# EAGLE schematic PLCPart (EAGLE 9.6.2)
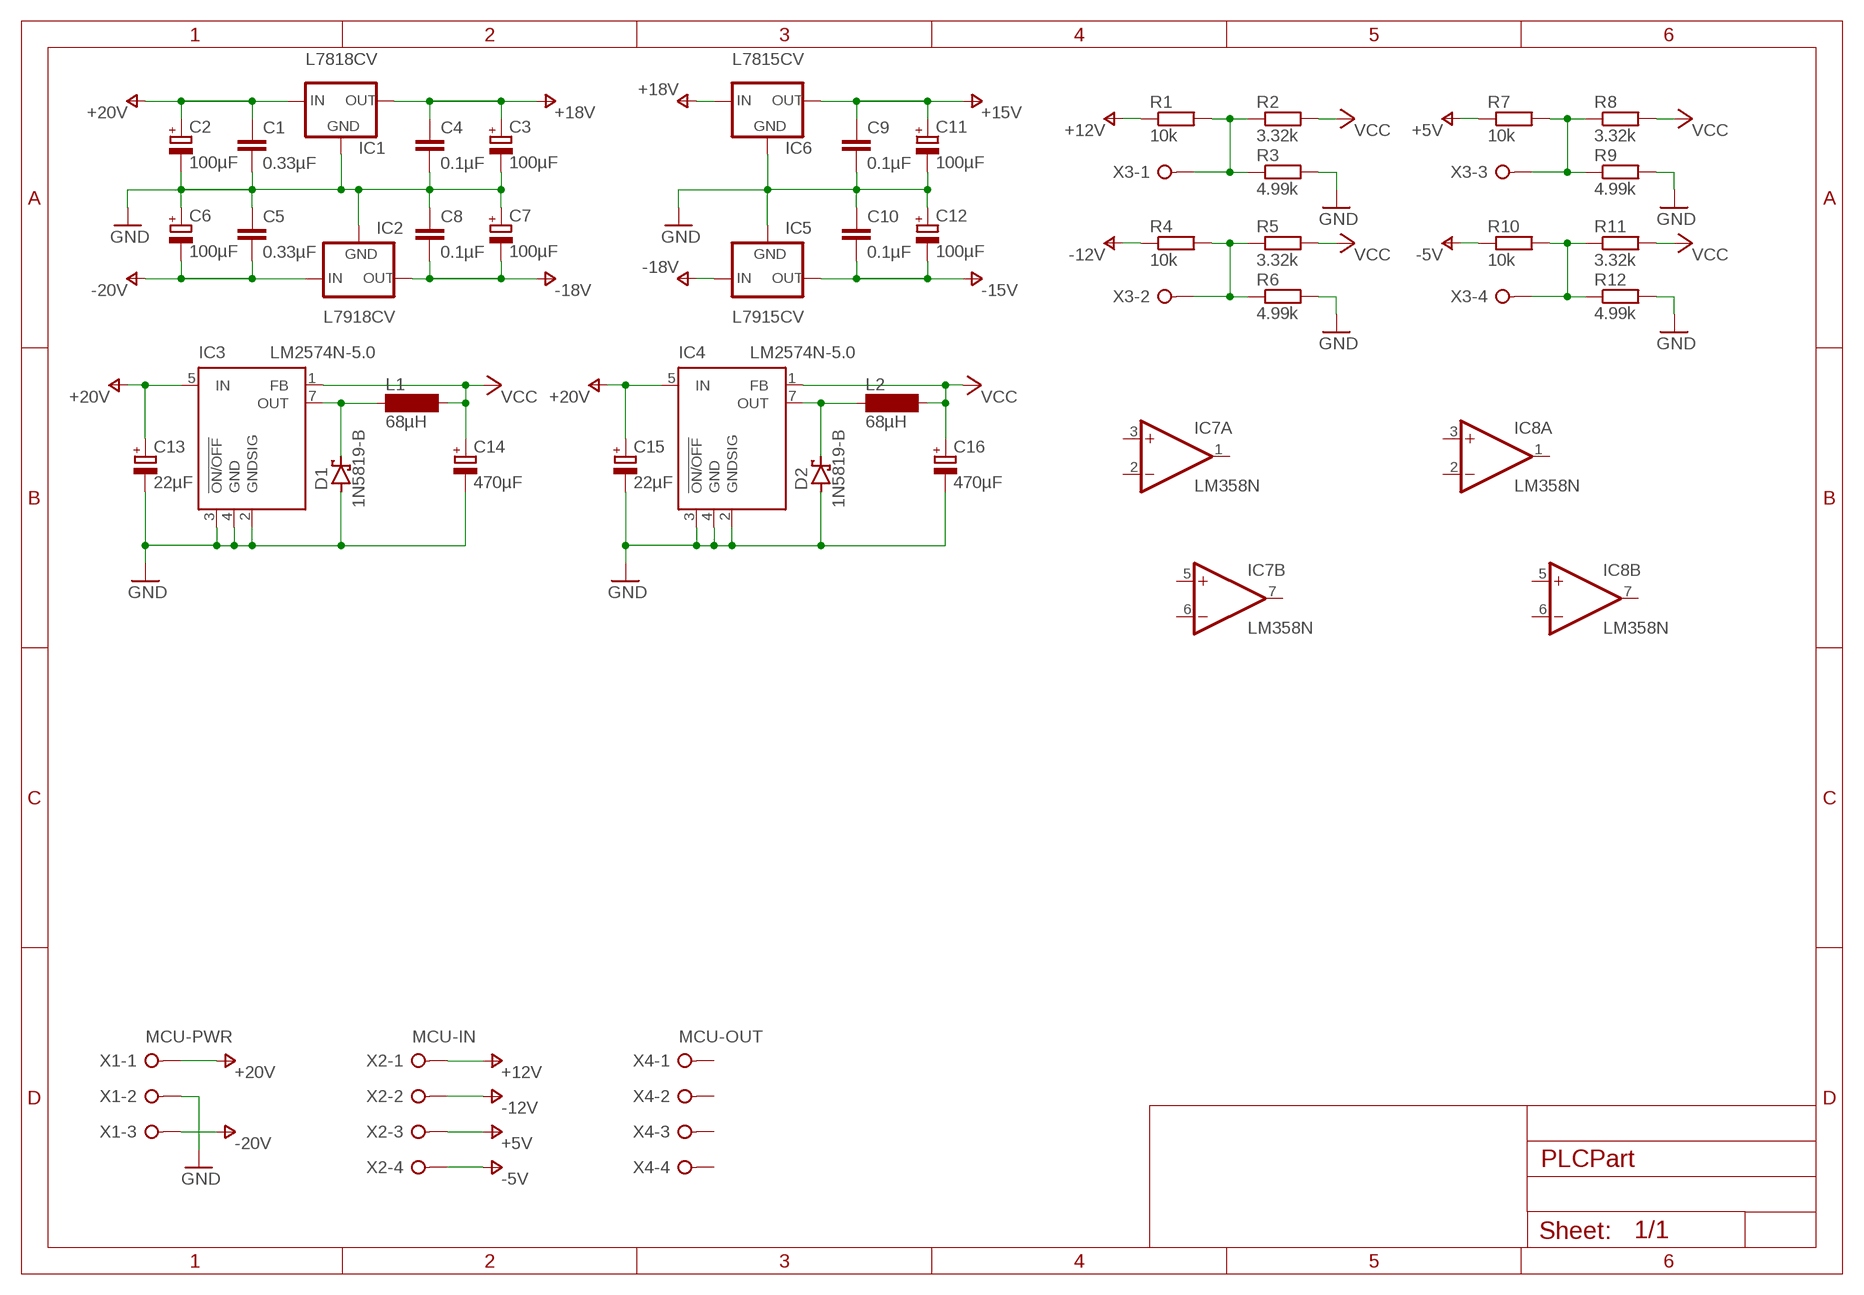
[diagram p0: schematic, sheet 1]

## Parts
C1  0.33µF  C-EU050-024X044  [C050-024X044]
C2  100µF  CPOL-EUE2.5-6  [E2,5-6]
C3  100µF  CPOL-EUE2.5-6  [E2,5-6]
C4  0.1µF  C-EU050-024X044  [C050-024X044]
C5  0.33µF  C-EU050-024X044  [C050-024X044]
C6  100µF  CPOL-EUE2.5-6  [E2,5-6]
C7  100µF  CPOL-EUE2.5-6  [E2,5-6]
C8  0.1µF  C-EU050-024X044  [C050-024X044]
C9  0.1µF  C-EU050-024X044  [C050-024X044]
C10  0.1µF  C-EU050-024X044  [C050-024X044]
C11  100µF  CPOL-EUE2.5-6  [E2,5-6]
C12  100µF  CPOL-EUE2.5-6  [E2,5-6]
C13  22µF  CPOL-EUE2-5  [E2-5]
C14  470µF  CPOL-EUE2-5  [E2-5]
C15  22µF  CPOL-EUE2-5  [E2-5]
C16  470µF  CPOL-EUE2-5  [E2-5]
D1  1N5819-B  [DO41-7.6]
D2  1N5819-B  [DO41-7.6]
IC1  L7818CV  78XXS  [78XXS]
IC2  L7918CV  79XXS  [79XXS]
IC3  LM2574N-5.0  [DIL08]
IC4  LM2574N-5.0  [DIL08]
IC5  L7915CV  79XXS  [79XXS]
IC6  L7815CV  78XXS  [78XXS]
IC7  LM358N  [DIL08]
IC8  LM358N  [DIL08]
L1  68µH  SD12K100  [SD12K100]
L2  68µH  SD12K100  [SD12K100]
R1  10k  R-EU_0207/10  [0207/10]
R2  3.32k  R-EU_0207/10  [0207/10]
R3  4.99k  R-EU_0207/10  [0207/10]
R4  10k  R-EU_0207/10  [0207/10]
R5  3.32k  R-EU_0207/10  [0207/10]
R6  4.99k  R-EU_0207/10  [0207/10]
R7  10k  R-EU_0207/10  [0207/10]
R8  3.32k  R-EU_0207/10  [0207/10]
R9  4.99k  R-EU_0207/10  [0207/10]
R10  10k  R-EU_0207/10  [0207/10]
R11  3.32k  R-EU_0207/10  [0207/10]
R12  4.99k  R-EU_0207/10  [0207/10]
X1  MCU-PWR  W237-03P  [W237-133]
X2  MCU-IN  W237-04P  [W237-4P]
X3  W237-04P  [W237-4P]
X4  MCU-OUT  W237-04P  [W237-4P]

## Nets
+5V: R7.1 X2.3
+12V: R1.1 X2.1
+15V: C9.1 C11.+ IC6.OUT
+18V: C3.+ C4.1 IC1.OUT IC6.IN
+20V: C1.1 C2.+ C13.+ C15.+ IC1.IN IC3.5(IN) IC4.5(IN) X1.1
-5V: R10.1 X2.4
-12V: R4.1 X2.2
-15V: C10.2 C12.- IC5.OUT
-18V: C7.- C8.2 IC2.OUT IC5.IN
-20V: C5.2 C6.- IC2.IN X1.3
GND: C1.2 C2.- C3.- C4.2 C5.1 C6.+ C7.+ C8.1 C9.2 C10.1 C11.- C12.+ C13.- C14.- C15.- C16.- D1.A D2.A IC1.GND IC2.GND IC3.2(GNDSIG) IC3.3(!ON/OFF) IC3.4(GND) IC4.2(GNDSIG) IC4.3(!ON/OFF) IC4.4(GND) IC5.GND IC6.GND R3.2 R6.2 R9.2 R12.2 X1.2
N$1: R1.2 R2.1 R3.1 X3.1
N$2: R4.2 R5.1 R6.1 X3.2
N$3: R7.2 R8.1 R9.1 X3.3
N$4: R10.2 R11.1 R12.1 X3.4
N$5: D1.C IC3.7(OUT) L1.1
N$6: D2.C IC4.7(OUT) L2.1
VCC: C14.+ C16.+ IC3.1(FB) IC4.1(FB) L1.2 L2.2 R2.2 R5.2 R8.2 R11.2
Unconnected: IC7.1(A:OUT) IC7.2(A:-IN) IC7.3(A:+IN) IC7.5(B:+IN) IC7.6(B:-IN) IC7.7(B:OUT) IC8.1(A:OUT) IC8.2(A:-IN) IC8.3(A:+IN) IC8.5(B:+IN) IC8.6(B:-IN) IC8.7(B:OUT) X4.1 X4.2 X4.3 X4.4

## Power pins joined to a net without a drawn wire
V+: IC7.8(P:V+) IC8.8(P:V+)
V-: IC7.4(P:V-) IC8.4(P:V-)

## Library data of the parts
C1 C4 C5 C8-C10 = rcl:C-EU: CAPACITOR, European symbol; SPICEPREFIX: C
C2 C3 C6 C7 C11-C16 = rcl:CPOL-EU: POLARIZED CAPACITOR, European symbol; SPICEPREFIX: C
D1 D2 = diode:1N581*: 1.0A SCHOTTKY BARRIER RECTIFIER Source: http://www.diodes.com/datasheets/ds23001.pdf
IC1 IC6 = v-reg:78XXS: VOLTAGE REGULATOR
IC2 IC5 = v-reg:79XXS: VOLTAGE REGULATOR
IC3 IC4 = linear:LM2574?-*: SIMPLE SWITCHER 0.5A Step-Down Voltage Regulator Source: http://cache.national.com/ds/LM/LM2574.pdf
IC7 IC8 = linear:LM358: OP AMP also LM158; LM258; LM2904 Source: http://cache.national.com/ds/LM/LM158.pdf
L1 L2 = inductor-neosid:SD12: INDUCTOR nominal inductance; OC_FARNELL: unknown; OC_NEWARK: unknown
R1-R12 = rcl:R-EU_: RESISTOR, European symbol; SPICEPREFIX: R
X1 = con-wago-508:W237-03P: WAGO SREW CLAMP; OC_FARNELL: unknown; OC_NEWARK: unknown
X2-X4 = con-wago-508:W237-04P: WAGO SREW CLAMP; OC_FARNELL: unknown; OC_NEWARK: unknown